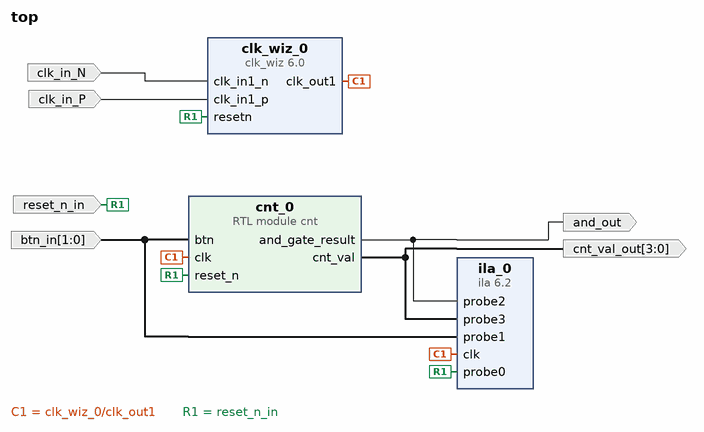
[diagram p0: block diagram of the top level]
# Vivado block design top, xcvu095-ffva2104-2-e, Vivado 2019.2.1
create_bd_design top

create_bd_port -dir I -type rst reset_n_in
create_bd_port -dir I -from 1 -to 0 btn_in
create_bd_port -dir O -from 3 -to 0 cnt_val_out
create_bd_port -dir O and_out
create_bd_port -dir I -type clk clk_in_N
set_property -dict {CONFIG.FREQ_HZ 125000000} [get_bd_ports clk_in_N]
create_bd_port -dir I -type clk clk_in_P
set_property -dict {CONFIG.FREQ_HZ 125000000} [get_bd_ports clk_in_P]

create_bd_cell -type ip -vlnv xilinx.com:ip:clk_wiz:6.0 clk_wiz_0
set_property -dict [list \
  CONFIG.CLKIN1_JITTER_PS 80.0 \
  CONFIG.CLKOUT1_JITTER 119.348 \
  CONFIG.CLKOUT1_PHASE_ERROR 96.948 \
  CONFIG.CLKOUT1_REQUESTED_OUT_FREQ 125.000 \
  CONFIG.CLK_IN1_BOARD_INTERFACE Custom \
  CONFIG.CLK_IN2_BOARD_INTERFACE Custom \
  CONFIG.MMCM_CLKFBOUT_MULT_F 8.000 \
  CONFIG.MMCM_CLKIN1_PERIOD 8.000 \
  CONFIG.MMCM_CLKIN2_PERIOD 10.000 \
  CONFIG.MMCM_CLKOUT0_DIVIDE_F 8.000 \
  CONFIG.MMCM_DIVCLK_DIVIDE 1 \
  CONFIG.PRIM_IN_FREQ 125 \
  CONFIG.PRIM_SOURCE Differential_clock_capable_pin \
  CONFIG.RESET_BOARD_INTERFACE Custom \
  CONFIG.RESET_PORT resetn \
  CONFIG.RESET_TYPE ACTIVE_LOW \
  CONFIG.USE_BOARD_FLOW true \
  CONFIG.USE_LOCKED false \
] [get_bd_cells clk_wiz_0]
create_bd_cell -type ip -vlnv xilinx.com:ip:ila:6.2 ila_0
set_property -dict [list \
  CONFIG.C_ENABLE_ILA_AXI_MON false \
  CONFIG.C_MONITOR_TYPE Native \
  CONFIG.C_NUM_OF_PROBES 4 \
  CONFIG.C_PROBE1_WIDTH 2 \
  CONFIG.C_PROBE3_WIDTH 4 \
] [get_bd_cells ila_0]
create_bd_cell -type module -reference cnt cnt_0

# ---- connections ----

connect_bd_net [get_bd_pins clk_wiz_0/clk_out1] [get_bd_pins ila_0/clk] [get_bd_pins cnt_0/clk]
connect_bd_net [get_bd_pins cnt_0/and_gate_result] [get_bd_pins ila_0/probe2] [get_bd_ports and_out]
connect_bd_net [get_bd_pins cnt_0/cnt_val] [get_bd_pins ila_0/probe3] [get_bd_ports cnt_val_out]
connect_bd_net [get_bd_ports reset_n_in] [get_bd_pins clk_wiz_0/resetn] [get_bd_pins ila_0/probe0] [get_bd_pins cnt_0/reset_n]
connect_bd_net [get_bd_ports btn_in] [get_bd_pins ila_0/probe1] [get_bd_pins cnt_0/btn]
connect_bd_net [get_bd_ports clk_in_N] [get_bd_pins clk_wiz_0/clk_in1_n]
connect_bd_net [get_bd_ports clk_in_P] [get_bd_pins clk_wiz_0/clk_in1_p]

validate_bd_design
save_bd_design
